# Altium project 102711.PrjPcb
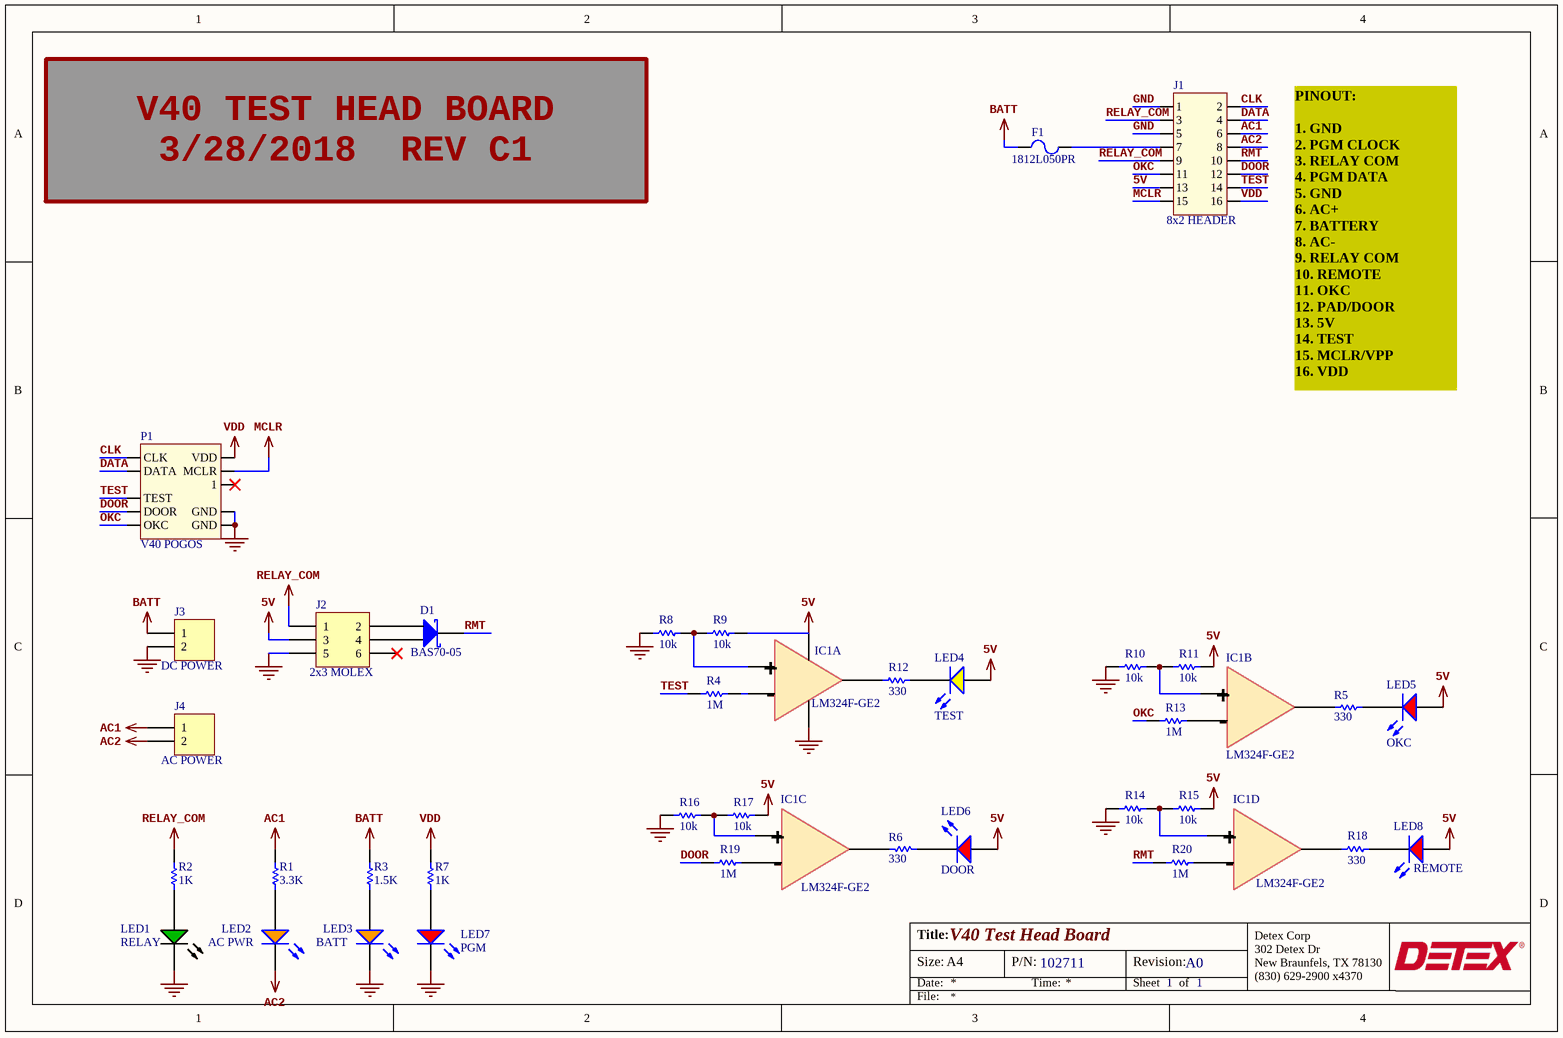
[diagram p0: 102711.SchDoc]
1 sheet, 36 parts. Net scope: global (net labels, ports and power ports of the same name join across sheets).
Board files: 106756.PcbDoc, 102711_C0.PcbDoc

## Sheet 102711.SchDoc: V40 Test Head Board
size A4; Author: DMH; CompanyName: Detex Corp; Engineer: DMH; Address2: Detex Corp; Address3: 302 Detex Dr; Address4: New Braunfels, TX 78130; DocumentNumber: 102711; Revision: A0; SheetNumber: 1; SheetTotal: 1; DocumentName: V40 Test Head Board; ProjectName: V40 Test Head Board

### Parts
D1  BAS70-05  [SOT-23_M]
F1  1812L050PR  [LFUS-1812L050_V]
IC1  LM324F-GE2  [SOIC14]  (parts A,B,C,D of 4)
J1  DESC: 8x2 HEADER  [HDR2X8]  (hidden comment: 2x8 Header)
J2  2x3 MOLEX  [HDR2X3]
J3  DC POWER  [BAT_CONN]
J4  AC POWER  [HDR1X2]
LED1  RELAY  [LTST-C170YKT_V]
LED2  AC PWR  [LTST-C170YKT_V]
LED3  BATT  [LTST-C170YKT_V]
LED4  TEST  [LTST-C170YKT_V]
LED5  OKC  [LTST-C170YKT_V]
LED6  DOOR  [LTST-C170YKT_V]
LED7  PGM  [LTST-C170YKT_V]
LED8  REMOTE  [LTST-C170YKT_V]
P1  V40 POGOS  [V40_POGOS]
R1  value 3.3K  [RESC0805(2012)_M]  (hidden comment: Res1)
R2  value 1K  [RESC0805(2012)_M]  (hidden comment: Res1)
R3  value 1.5K  [RESC0805(2012)_M]  (hidden comment: Res1)
R4  value 1M  [RESC0805(2012)_M]  (hidden comment: Res1)
R5  value 330  [RESC0805(2012)_M]  (hidden comment: Res1)
R6  value 330  [RESC0805(2012)_M]  (hidden comment: Res1)
R7  value 1K  [RESC0805(2012)_M]  (hidden comment: Res1)
R8  value 10k  [RESC0805(2012)_M]  (hidden comment: Res1)
R9  value 10k  [RESC0805(2012)_M]  (hidden comment: Res1)
R10  value 10k  [RESC0805(2012)_M]  (hidden comment: Res1)
R11  value 10k  [RESC0805(2012)_M]  (hidden comment: Res1)
R12  value 330  [RESC0805(2012)_M]  (hidden comment: Res1)
R13  value 1M  [RESC0805(2012)_M]  (hidden comment: Res1)
R14  value 10k  [RESC0805(2012)_M]  (hidden comment: Res1)
R15  value 10k  [RESC0805(2012)_M]  (hidden comment: Res1)
R16  value 10k  [RESC0805(2012)_M]  (hidden comment: Res1)
R17  value 10k  [RESC0805(2012)_M]  (hidden comment: Res1)
R18  value 330  [RESC0805(2012)_M]  (hidden comment: Res1)
R19  value 1M  [RESC0805(2012)_M]  (hidden comment: Res1)
R20  value 1M  [RESC0805(2012)_M]  (hidden comment: Res1)

### Nets
5V: J1.13 J2.3 LED4.1(A) LED5.1(A) LED6.1(A) LED8.1(A) R9.2 R11.2 R15.2 R17.2
AC1: J1.6 J4.1 R1.1
AC2: J1.8 J4.2 LED2.2(K)
BATT: F1.1 J3.1 R3.2
GND: IC1.4(VCC) J1.1 J1.5 J2.5 J3.2 LED1.2(K) LED3.2(K) LED7.2(K) P1.2(GND) P1.8(GND) R8.1 R10.1 R14.1 R16.1
MCLR: J1.15 P1.5(MCLR)
RELAY_COM: J1.3 J1.9 J2.1 R2.1
VDD: J1.16 P1.6(VDD) R7.1
CLK: J1.2 P1.3(CLK)
DATA: J1.4 P1.4(DATA)
DOOR: J1.12 P1.9(DOOR) R19.1
OKC: J1.11 P1.10(OKC) R13.1
RMT: D1.3(K) J1.10 R20.1
TEST: J1.14 P1.7(TEST) R4.1
NetD1_1: D1.1(A) J2.4
NetD1_2: D1.2(A) J2.2
NetF1_2: F1.2 J1.7
NetIC1_1: IC1.1(OUT1) R12.1
NetIC1_2: IC1.2(-IN1) R4.2
NetIC1_3: IC1.3(+IN1) R8.2 R9.1
NetIC1_5: IC1.5(+IN2) R10.2 R11.1
NetIC1_6: IC1.6(-IN2) R13.2
NetIC1_7: IC1.7(OUT2) R5.2
NetIC1_8: IC1.8(OUT3) R6.1
NetIC1_9: IC1.9(-IN3) R19.2
NetIC1_10: IC1.10(+IN3) R16.2 R17.1
NetIC1_12: IC1.12(+IN4) R14.2 R15.1
NetIC1_13: IC1.13(-IN4) R20.2
NetIC1_14: IC1.14(OUT4) R18.1
NetLED1_1: LED1.1(A) R2.2
NetLED2_1: LED2.1(A) R1.2
NetLED3_1: LED3.1(A) R3.1
NetLED4_2: LED4.2(K) R12.2
NetLED5_2: LED5.2(K) R5.1
NetLED6_2: LED6.2(K) R6.2
NetLED7_1: LED7.1(A) R7.2
NetLED8_2: LED8.2(K) R18.2

Not connected (* = marked no-connect by the designer): IC1 11(VEE); J2 6*; P1 1*

### Notes on the sheet
- V40 TEST HEAD BOARD
  3/28/2018  REV C1
- PINOUT:
  1. GND
  2. PGM CLOCK
  3. RELAY COM
  4. PGM DATA
  5. GND
  6. AC+
  7. BATTERY
  8. AC-
  9. RELAY COM
  10. REMOTE
  11. OKC
  12. PAD/DOOR
  13. 5V
  14. TEST
  15. MCLR/VPP
  16. VDD
- Title:
- Size:
- Date:
- A4
- P/N:
- Time:
- Revision:
- Sheet
- of
- (830) 629-2900 x4370
- File:
- (in symbol LM324F-GE2_1, part A) +; -
- (in symbol LM324F-GE2_1, part B) +; -
- (in symbol LM324F-GE2_1, part C) +; -
- (in symbol LM324F-GE2_1, part D) +; -

### Library data of the parts
D1 = D Schottky: Dual Schottky Diode; MFR: DIODES, INC; IFmax: 70mA; PackageReference: SOT23; ComponentLink1URL: http://www.mouser.com/ds/2/115/ds11007-768590.pdf; MFR P/N: BAS70-05; ComponentLink1Description: Datasheet
F1 = CMP-1700-00002-1: POLY-FUSE(R) Resettable PTC, 0.5 A, 0.15 to 1 Ohm Resistance, -40 to 85 degC, 1812 (4532 Metric), RoHS, Tape and Reel; Voltage Rating: 50 V; Power Rating: 100 mW; Resistance: 150 kohm; Tolerance: 1%; Case\Package: 0603; ComponentLink2URL: http://www.littelfuse.com/~/media/electronics/datasheets/resettable_ptcs/littelfuse_ptc_1812l_datasheet.pdf.pdf; Pins: 2; Mount: Surface Mount; Width: 0.8 mm; Length: 1.6 mm; Package Quantity: 1; Max Operating Temperature: 155 degC; Case Code (Imperial): 0603; ComponentLink1Description: Manufacturer URL; PackageReference: 1812; ComponentLink1URL: http://www.littelfuse.com/; RoHSCompliant: true; Voltage Rating (DC): 50 V; Packaging: Tape and Reel; PackageDescription: 2-Pin Surface Mount Device, Body 4.55 x 3.24 mm; Min Operating Temperature: -55 degC; DatasheetVersion: Feb-16; REACH SVHC: No SVHC; Case Code (Metric): 1608; ComponentLink2Description: Datasheet; Height: 0.45 mm
IC1 = LM324F-GE2_1: Quad Operational Amplifier 3-32V; ComponentLink1Description: Datasheet; ComponentLink1URL: https://www.mouser.com/ds/2/348/m358f-e-1265268.pdf
J1 = 2x9 Header
J2 = Header 3X2: Header, 3-Pin, Dual row; LatestRevisionDate: 17-Jul-2002; LatestRevisionNote: Re-released for DXP Platform.; Publisher: Altium Limited
J3 J4 = Header 2: Header, 2-Pin; LatestRevisionDate: 17-Jul-2002; LatestRevisionNote: Re-released for DXP Platform.; Publisher: Altium Limited
LED1 = CMP-1674-00007-1: LED Uni-Color Green, 100 mW, 5 V, -55 to 85 degC, 2-Pin SMD, RoHS, Tape and Reel; ComponentLink2Description: Datasheet; ComponentLink2URL: http://datasheet.octopart.com/LTST-C190GKT-Lite-On-datasheet-158530.pdf; ComponentLink1Description: Manufacturer URL; PackageReference: C190GKT; PackageDescription: 2-Pin Surface Mount Device, Body 1.6 x 0.8 mm; ComponentLink1URL: http://www.us.liteon.com/; DatasheetVersion: Dec-06
LED2 LED3 = LED-ORANGE-AK-2
LED4 = CMP-1674-00003-5: LED Uni-Color Yellow, 60 mW, 80 mA, -55 to 85 degC, 2-Pin SMD, RoHS, Tape and Reel; Manufacturer: Lite-On; Mounting Technology: Surface Mount; Height: 1.1 mm; Mount: Surface Mount; Packaging: Tape and Reel; Length: 2 mm; RoHSCompliant: true; Colour: Yellow; Max Operating Temperature: 85 degC; PackageReference: C170YKT; ComponentLink1Description: Manufacturer URL; Min Operating Temperature: -55 degC; ComponentLink1URL: http://www.us.liteon.com/; DatasheetVersion: 03/2000; PackageDescription: 2-Pin Surface Mount Device, Body 2 x 1.25 mm; ComponentLink2URL: http://media.digikey.com/pdf/Data Sheets/Lite-On PDFs/LTST-C170YKT.pdf; Package Quantity: 3000; ComponentLink2Description: Datasheet; Pins: 2; DESC: TEST
LED5-LED7 = CMP-1674-00001-5: LED Uni-Color Red, 100 mW, 200 mA, -55 to 85 degC, 2-Pin SMD, RoHS, Tape and Reel; Manufacturer: Lite-On; ComponentLink1Description: Manufacturer URL; PackageReference: C170CKT; Package Quantity: 3000; Packaging: Tape and Reel; Pins: 2; ComponentLink2URL: http://media.digikey.com/pdf/Data%20Sheets/Lite-On%20PDFs/LTST-C170CKT.pdf; Max Operating Temperature: 85 degC; Min Operating Temperature: -55 degC; ComponentLink1URL: http://www.us.liteon.com/; Mounting Technology: Surface Mount; Mount: Surface Mount; Length: 2 mm; ComponentLink2Description: Datasheet; DatasheetVersion: 03/2003; Height: 1.1 mm; PackageDescription: 2-Pin Surface Mount Device, Body 2 x 1.25 mm; RoHSCompliant: true; Colour: Red
  LED5: DESC: OKC
  LED6: DESC: DOOR
  LED7: DESC: PGM
LED8 = CMP-1674-00001-5: LED Uni-Color Red, 100 mW, 200 mA, -55 to 85 degC, 2-Pin SMD, RoHS, Tape and Reel; Manufacturer: Lite-On; DESC: PGM; ComponentLink1Description: Manufacturer URL; PackageReference: C170CKT; Package Quantity: 3000; Packaging: Tape and Reel; Pins: 2; ComponentLink2URL: http://media.digikey.com/pdf/Data%20Sheets/Lite-On%20PDFs/LTST-C170CKT.pdf; Max Operating Temperature: 85 degC; Min Operating Temperature: -55 degC; ComponentLink1URL: http://www.us.liteon.com/; Mounting Technology: Surface Mount; Mount: Surface Mount; Length: 2 mm; ComponentLink2Description: Datasheet; DatasheetVersion: 03/2003; Height: 1.1 mm; PackageDescription: 2-Pin Surface Mount Device, Body 2 x 1.25 mm; RoHSCompliant: true; Colour: Red
P1 = V40_POGOS
R1-R20 = Res1: Resistor; Published: 8-Jun-2000; LatestRevisionDate: 17-Jul-2002; LatestRevisionNote: Re-released for DXP Platform.; PackageReference: AXIAL-0.3; Publisher: Altium Limited; PackageDescription: Axial Device, Thru-Hole; 2 Leads; 0.3 in Pin Spacing